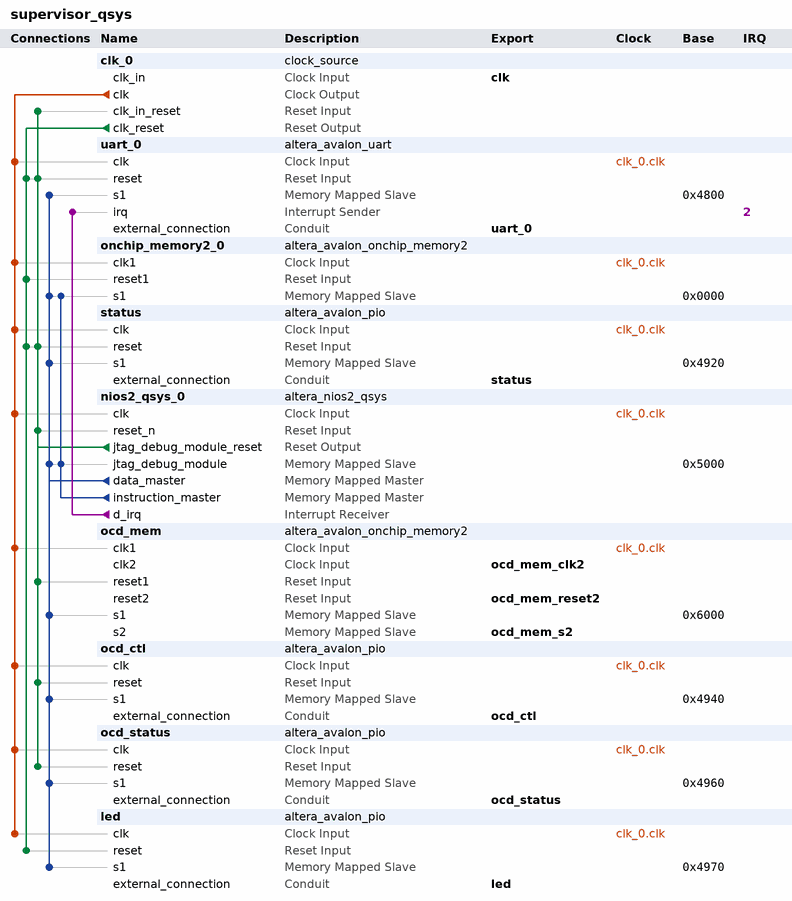
[diagram p0: system contents]
# Platform Designer (Qsys) system supervisor_qsys, Cyclone IV E EP4CE22E22C7
# Parameters at their usual value, and those the tool derives, are not listed.
package require -exact qsys 15.0
create_system supervisor_qsys
set_project_property DEVICE_FAMILY {Cyclone IV E}
set_project_property DEVICE EP4CE22E22C7

add_instance clk_0 clock_source 15.0
set_instance_parameter_value clk_0 clockFrequency 40000000

add_instance uart_0 altera_avalon_uart 15.0
set_instance_parameter_value uart_0 baud 115200
set_instance_parameter_value uart_0 dataBits 8
set_instance_parameter_value uart_0 fixedBaud true
set_instance_parameter_value uart_0 parity NONE
set_instance_parameter_value uart_0 stopBits 1

add_instance onchip_memory2_0 altera_avalon_onchip_memory2 15.0
set_instance_parameter_value onchip_memory2_0 dataWidth 32
set_instance_parameter_value onchip_memory2_0 dualPort false
set_instance_parameter_value onchip_memory2_0 initMemContent true
set_instance_parameter_value onchip_memory2_0 initializationFileName onchip_mem.hex
set_instance_parameter_value onchip_memory2_0 memorySize 16384

add_instance status altera_avalon_pio 15.0
set_instance_parameter_value status direction Output
set_instance_parameter_value status width 2

add_instance nios2_qsys_0 altera_nios2_qsys 15.0
set_instance_parameter_value nios2_qsys_0 breakSlave nios2_qsys_0.jtag_debug_module
set_instance_parameter_value nios2_qsys_0 exceptionSlave onchip_memory2_0.s1
set_instance_parameter_value nios2_qsys_0 icache_size 512
set_instance_parameter_value nios2_qsys_0 impl Tiny
set_instance_parameter_value nios2_qsys_0 mmu_TLBMissExcSlave None
set_instance_parameter_value nios2_qsys_0 resetSlave onchip_memory2_0.s1
set_instance_parameter_value nios2_qsys_0 resetrequest_enabled true

add_instance ocd_mem altera_avalon_onchip_memory2 15.0
set_instance_parameter_value ocd_mem dataWidth 16
set_instance_parameter_value ocd_mem dualPort true
set_instance_parameter_value ocd_mem initMemContent false
set_instance_parameter_value ocd_mem initializationFileName onchip_mem.hex
set_instance_parameter_value ocd_mem memorySize 1024

add_instance ocd_ctl altera_avalon_pio 15.0
set_instance_parameter_value ocd_ctl direction Output
set_instance_parameter_value ocd_ctl width 1

add_instance ocd_status altera_avalon_pio 15.0
set_instance_parameter_value ocd_status direction Input
set_instance_parameter_value ocd_status width 1

add_instance led altera_avalon_pio 15.0
set_instance_parameter_value led direction Output
set_instance_parameter_value led width 1

# connections
add_connection clk_0.clk led.clk clock
add_connection clk_0.clk nios2_qsys_0.clk clock
add_connection clk_0.clk ocd_ctl.clk clock
add_connection clk_0.clk ocd_mem.clk1 clock
add_connection clk_0.clk ocd_status.clk clock
add_connection clk_0.clk onchip_memory2_0.clk1 clock
add_connection clk_0.clk status.clk clock
add_connection clk_0.clk uart_0.clk clock
add_connection clk_0.clk_reset led.reset reset
add_connection clk_0.clk_reset onchip_memory2_0.reset1 reset
add_connection clk_0.clk_reset status.reset reset
add_connection clk_0.clk_reset uart_0.reset reset
add_connection nios2_qsys_0.jtag_debug_module_reset clk_0.clk_in_reset reset
add_connection nios2_qsys_0.jtag_debug_module_reset nios2_qsys_0.reset_n reset
add_connection nios2_qsys_0.jtag_debug_module_reset ocd_ctl.reset reset
add_connection nios2_qsys_0.jtag_debug_module_reset ocd_mem.reset1 reset
add_connection nios2_qsys_0.jtag_debug_module_reset ocd_status.reset reset
add_connection nios2_qsys_0.jtag_debug_module_reset status.reset reset
add_connection nios2_qsys_0.jtag_debug_module_reset uart_0.reset reset
add_connection nios2_qsys_0.data_master led.s1 avalon
set_connection_parameter_value nios2_qsys_0.data_master/led.s1 baseAddress 0x4970
add_connection nios2_qsys_0.data_master nios2_qsys_0.jtag_debug_module avalon
set_connection_parameter_value nios2_qsys_0.data_master/nios2_qsys_0.jtag_debug_module baseAddress 0x5000
add_connection nios2_qsys_0.data_master ocd_ctl.s1 avalon
set_connection_parameter_value nios2_qsys_0.data_master/ocd_ctl.s1 baseAddress 0x4940
add_connection nios2_qsys_0.data_master ocd_mem.s1 avalon
set_connection_parameter_value nios2_qsys_0.data_master/ocd_mem.s1 baseAddress 0x6000
add_connection nios2_qsys_0.data_master ocd_status.s1 avalon
set_connection_parameter_value nios2_qsys_0.data_master/ocd_status.s1 baseAddress 0x4960
add_connection nios2_qsys_0.data_master onchip_memory2_0.s1 avalon
set_connection_parameter_value nios2_qsys_0.data_master/onchip_memory2_0.s1 baseAddress 0x0000
add_connection nios2_qsys_0.data_master status.s1 avalon
set_connection_parameter_value nios2_qsys_0.data_master/status.s1 baseAddress 0x4920
add_connection nios2_qsys_0.data_master uart_0.s1 avalon
set_connection_parameter_value nios2_qsys_0.data_master/uart_0.s1 baseAddress 0x4800
add_connection nios2_qsys_0.instruction_master nios2_qsys_0.jtag_debug_module avalon
set_connection_parameter_value nios2_qsys_0.instruction_master/nios2_qsys_0.jtag_debug_module baseAddress 0x5000
add_connection nios2_qsys_0.instruction_master onchip_memory2_0.s1 avalon
set_connection_parameter_value nios2_qsys_0.instruction_master/onchip_memory2_0.s1 baseAddress 0x0000
add_connection nios2_qsys_0.d_irq uart_0.irq interrupt
set_connection_parameter_value nios2_qsys_0.d_irq/uart_0.irq irqNumber 2

# exported interfaces
add_interface clk clock sink
set_interface_property clk EXPORT_OF clk_0.clk_in
add_interface led conduit end
set_interface_property led EXPORT_OF led.external_connection
add_interface ocd_ctl conduit end
set_interface_property ocd_ctl EXPORT_OF ocd_ctl.external_connection
add_interface ocd_mem_clk2 clock sink
set_interface_property ocd_mem_clk2 EXPORT_OF ocd_mem.clk2
add_interface ocd_mem_reset2 reset sink
set_interface_property ocd_mem_reset2 EXPORT_OF ocd_mem.reset2
add_interface ocd_mem_s2 avalon slave
set_interface_property ocd_mem_s2 EXPORT_OF ocd_mem.s2
add_interface ocd_status conduit end
set_interface_property ocd_status EXPORT_OF ocd_status.external_connection
add_interface status conduit end
set_interface_property status EXPORT_OF status.external_connection
add_interface uart_0 conduit end
set_interface_property uart_0 EXPORT_OF uart_0.external_connection

set_interconnect_requirement {$system} qsys_mm.clockCrossingAdapter HANDSHAKE
set_interconnect_requirement {$system} qsys_mm.insertDefaultSlave false
set_interconnect_requirement {$system} qsys_mm.maxAdditionalLatency 0

save_system supervisor_qsys.qsys
